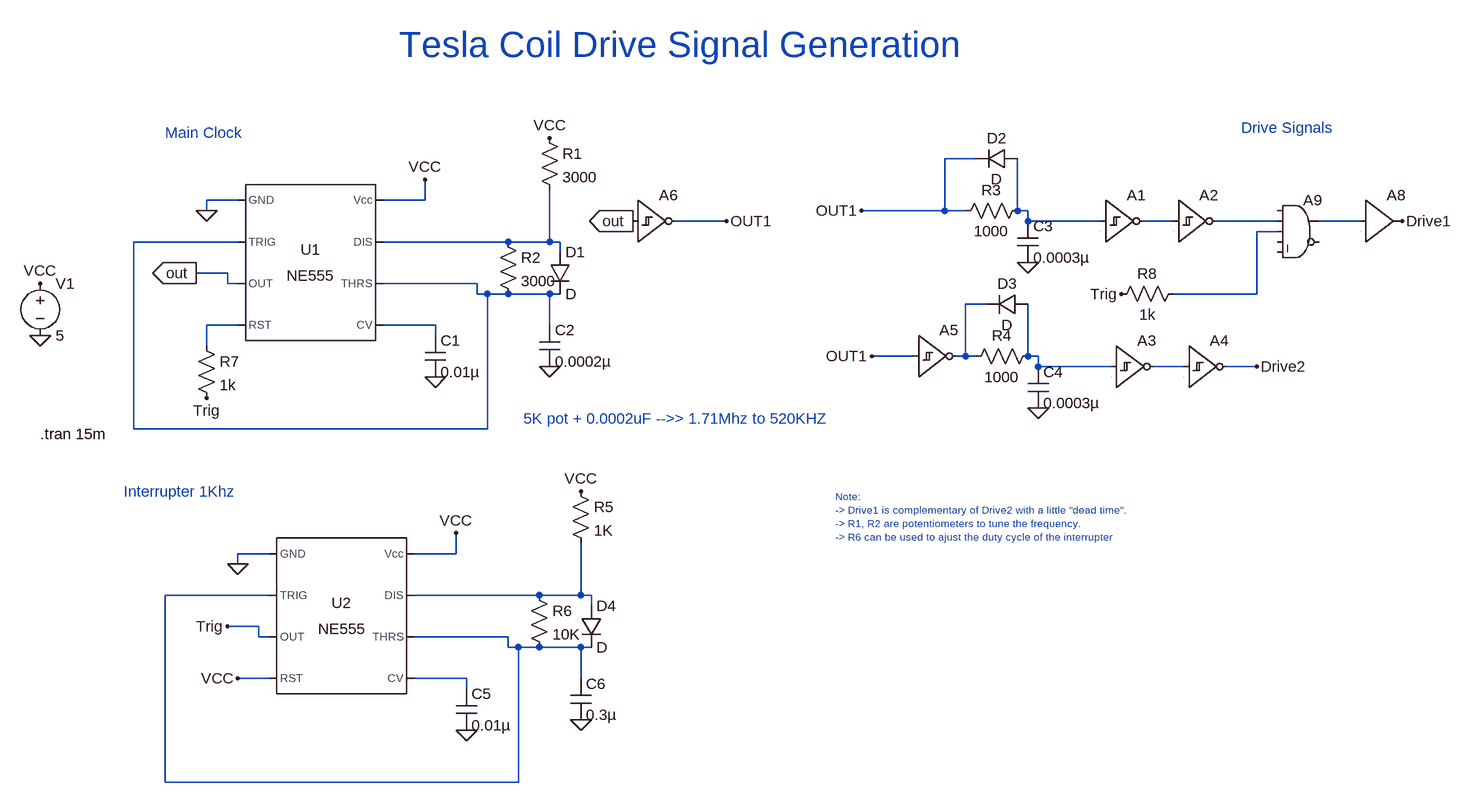
[diagram p0: schematic Tesla_coil_Gate_Drive_Signal_Generation.asc]
Tesla_coil_Gate_Drive_Signal_Generation.asc, the LTspice schematic file:
Version 4
SHEET 1 1772 900
WIRE 928 -64 880 -64
WIRE -208 0 -256 0
WIRE 80 0 80 -32
WIRE 80 0 16 0
WIRE -256 16 -256 0
WIRE 880 16 880 -64
WIRE 880 16 752 16
WIRE 912 16 880 16
WIRE 992 16 992 -64
WIRE 1008 16 992 16
WIRE 544 32 464 32
WIRE 1008 32 1008 16
WIRE 1120 32 1008 32
WIRE 1232 32 1184 32
WIRE 1392 32 1296 32
WIRE 1520 32 1456 32
WIRE 1392 48 1360 48
WIRE -208 64 -368 64
WIRE 208 64 16 64
WIRE 272 64 272 -16
WIRE 272 64 208 64
WIRE 288 64 272 64
WIRE 288 80 288 64
WIRE -224 112 -272 112
WIRE -224 128 -224 112
WIRE -208 128 -224 128
WIRE 160 128 16 128
WIRE 160 144 160 128
WIRE 176 144 160 144
WIRE 208 144 176 144
WIRE 272 144 208 144
WIRE 288 144 272 144
WIRE 1360 144 1360 48
WIRE 1360 144 1232 144
WIRE 944 160 912 160
WIRE -208 192 -256 192
WIRE 96 192 16 192
WIRE 272 192 272 144
WIRE 96 208 96 192
WIRE -256 224 -256 192
WIRE 832 240 768 240
WIRE 912 240 912 160
WIRE 912 240 896 240
WIRE 928 240 912 240
WIRE 1008 240 1008 160
WIRE 1024 240 1008 240
WIRE 1024 256 1024 240
WIRE 1136 256 1024 256
WIRE 1248 256 1200 256
WIRE 1360 256 1312 256
WIRE -368 352 -368 64
WIRE 176 352 176 144
WIRE 176 352 -368 352
WIRE -160 544 -208 544
WIRE 128 544 128 512
WIRE 128 544 64 544
WIRE -208 560 -208 544
WIRE -160 608 -320 608
WIRE 256 608 64 608
WIRE 320 608 320 528
WIRE 320 608 256 608
WIRE 336 608 320 608
WIRE 336 624 336 608
WIRE -176 656 -224 656
WIRE -176 672 -176 656
WIRE -160 672 -176 672
WIRE 208 672 64 672
WIRE 208 688 208 672
WIRE 224 688 208 688
WIRE 256 688 224 688
WIRE 320 688 256 688
WIRE 336 688 320 688
WIRE -160 736 -208 736
WIRE 144 736 64 736
WIRE 320 736 320 688
WIRE 144 752 144 736
WIRE -320 896 -320 608
WIRE 224 896 224 688
WIRE 224 896 -320 896
FLAG 96 272 0
FLAG -256 16 0
FLAG 80 -32 VCC
FLAG -256 304 Trig
FLAG 272 -96 VCC
FLAG -272 112 out
IOPIN -272 112 Out
FLAG -512 208 0
FLAG 272 256 0
FLAG -512 128 VCC
FLAG 1008 96 0
FLAG 1024 320 0
FLAG 400 32 out
IOPIN 400 32 Out
FLAG 544 32 OUT1
FLAG 752 16 OUT1
FLAG 768 240 OUT1
FLAG 1584 32 Drive1
FLAG 1360 256 Drive2
FLAG 144 816 0
FLAG -208 560 0
FLAG 128 512 VCC
FLAG -208 736 VCC
FLAG 320 448 VCC
FLAG -224 656 Trig
FLAG 320 800 0
FLAG 1152 144 Trig
SYMBOL Misc\\NE555 -96 96 R0
SYMATTR InstName U1
SYMBOL cap 80 208 R0
SYMATTR InstName C1
SYMATTR Value 0.01µ
SYMBOL res 256 -112 R0
SYMATTR InstName R1
SYMATTR Value 3000
SYMBOL res 192 48 R0
SYMATTR InstName R2
SYMATTR Value 3000
SYMBOL diode 272 80 R0
SYMATTR InstName D1
SYMBOL cap 256 192 R0
SYMATTR InstName C2
SYMATTR Value 0.0002µ
SYMBOL voltage -512 112 R0
WINDOW 123 0 0 Left 0
WINDOW 39 0 0 Left 0
SYMATTR InstName V1
SYMATTR Value 5
SYMBOL cap 992 32 R0
SYMATTR InstName C3
SYMATTR Value 0.0003µ
SYMBOL res 1008 0 R90
WINDOW 0 0 56 VBottom 2
WINDOW 3 32 56 VTop 2
SYMATTR InstName R3
SYMATTR Value 1000
SYMBOL Digital\\schmtinv 1120 -32 R0
WINDOW 3 0 0 Invisible 0
SYMATTR Value Vhigh = 5V
SYMATTR InstName A1
SYMBOL Digital\\schmtinv 1232 -32 R0
WINDOW 3 0 0 Invisible 0
SYMATTR Value Vhigh = 5V
SYMATTR InstName A2
SYMBOL cap 1008 256 R0
SYMATTR InstName C4
SYMATTR Value 0.0003µ
SYMBOL res 1024 224 R90
WINDOW 0 0 56 VBottom 2
WINDOW 3 32 56 VTop 2
SYMATTR InstName R4
SYMATTR Value 1000
SYMBOL Digital\\schmtinv 1136 192 R0
WINDOW 3 0 0 Invisible 0
SYMATTR Value Vhigh = 5V
SYMATTR InstName A3
SYMBOL Digital\\schmtinv 1248 192 R0
WINDOW 3 0 0 Invisible 0
SYMATTR Value Vhigh = 5V
SYMATTR InstName A4
SYMBOL Digital\\schmtinv 832 176 R0
WINDOW 3 0 0 Invisible 0
SYMATTR Value Vhigh = 5V
SYMATTR InstName A5
SYMBOL Digital\\schmtinv 400 -32 R0
WINDOW 3 0 0 Invisible 0
SYMATTR Value Vhigh = 5V
SYMATTR InstName A6
SYMBOL diode 992 -80 R90
WINDOW 0 0 32 VBottom 2
WINDOW 3 32 32 VTop 2
SYMATTR InstName D2
SYMBOL diode 1008 144 R90
WINDOW 0 0 32 VBottom 2
WINDOW 3 32 32 VTop 2
SYMATTR InstName D3
SYMBOL Misc\\NE555 -48 640 R0
SYMATTR InstName U2
SYMBOL cap 128 752 R0
SYMATTR InstName C5
SYMATTR Value 0.01µ
SYMBOL res 304 432 R0
SYMATTR InstName R5
SYMATTR Value 1K
SYMBOL res 240 592 R0
SYMATTR InstName R6
SYMATTR Value 10K
SYMBOL diode 320 624 R0
SYMATTR InstName D4
SYMBOL cap 304 736 R0
SYMATTR InstName C6
SYMATTR Value 0.3µ
SYMBOL res -272 208 R0
SYMATTR InstName R7
SYMATTR Value 1k
SYMBOL Digital\\buf1 1520 -32 R0
SYMATTR InstName A8
SYMATTR Value2 Vhigh = 5V
SYMBOL Digital\\and 1424 -16 R0
WINDOW 3 0 0 Invisible 0
SYMATTR Value Vhigh = 5V
SYMATTR InstName A9
SYMBOL res 1248 128 R90
WINDOW 0 0 56 VBottom 2
WINDOW 3 32 56 VTop 2
SYMATTR InstName R8
SYMATTR Value 1k
TEXT -512 360 Left 2 !.tran 15m
TEXT -320 -104 Left 2 ;Main Clock
TEXT -384 448 Left 2 ;Interrupter 1Khz
TEXT 1336 -112 Left 2 ;Drive Signals
TEXT 40 -240 Left 5 ;Tesla Coil Drive Signal Generation
TEXT 232 336 Left 2 ;5K pot + 0.0002uF -->> 1.71Mhz to 520KHZ
TEXT 712 456 Left 1 ;Note:\n-> Drive1 is complementary of Drive2 with a little "dead time".\n-> R1, R2 are potentiometers to tune the frequency. \n-> R6 can be used to ajust the duty cycle of the interrupter

The netlist it stands for:
* Tesla_coil_Gate_Drive_Signal_Generation.asc
XU1 0 N006 out N009 N010 N006 N007 VCC NE555  ; pins GND TRIG OUT RST CV THRS DIS Vcc
C1 N010 0 0.01µ
R1 VCC N007 3000
R2 N007 N006 3000
D1 N007 N006 D
C2 N006 0 0.0002µ
V1 VCC 0 5
C3 N001 0 0.0003µ
R3 N001 OUT1 1000
A1 N001 0 0 0 0 N002 0 0 SCHMITT Vhigh = 5V
A2 N002 0 0 0 0 N003 0 0 SCHMITT Vhigh = 5V
C4 N011 0 0.0003µ
R4 N011 N008 1000
A3 N011 0 0 0 0 N012 0 0 SCHMITT Vhigh = 5V
A4 N012 0 0 0 0 Drive2 0 0 SCHMITT Vhigh = 5V
A5 OUT1 0 0 0 0 N008 0 0 SCHMITT Vhigh = 5V
A6 out 0 0 0 0 OUT1 0 0 SCHMITT Vhigh = 5V
D2 N001 OUT1 D
D3 N011 N008 D
XU2 0 N013 Trig VCC N015 N013 N014 VCC NE555  ; pins GND TRIG OUT RST CV THRS DIS Vcc
C5 N015 0 0.01µ
R5 VCC N014 1K
R6 N014 N013 10K
D4 N014 N013 D
C6 N013 0 0.3µ
R7 N009 Trig 1k
A8 N004 0 0 0 0 0 Drive1 0 BUF Vhigh = 5V
A9 0 N003 N005 0 0 0 N004 0 AND Vhigh = 5V
R8 N005 Trig 1k
.model D D
.lib standard.dio
.tran 15m
* Main Clock
* Interrupter 1Khz
* Drive Signals
* Tesla Coil Drive Signal Generation
* 5K pot + 0.0002uF -->> 1.71Mhz to 520KHZ
* Note:
* -> Drive1 is complementary of Drive2 with a little "dead time".
* -> R1, R2 are potentiometers to tune the frequency.
* -> R6 can be used to ajust the duty cycle of the interrupter
.lib NE555.sub
.backanno
.end